# Altium project make_etf_great_again.PrjPcb
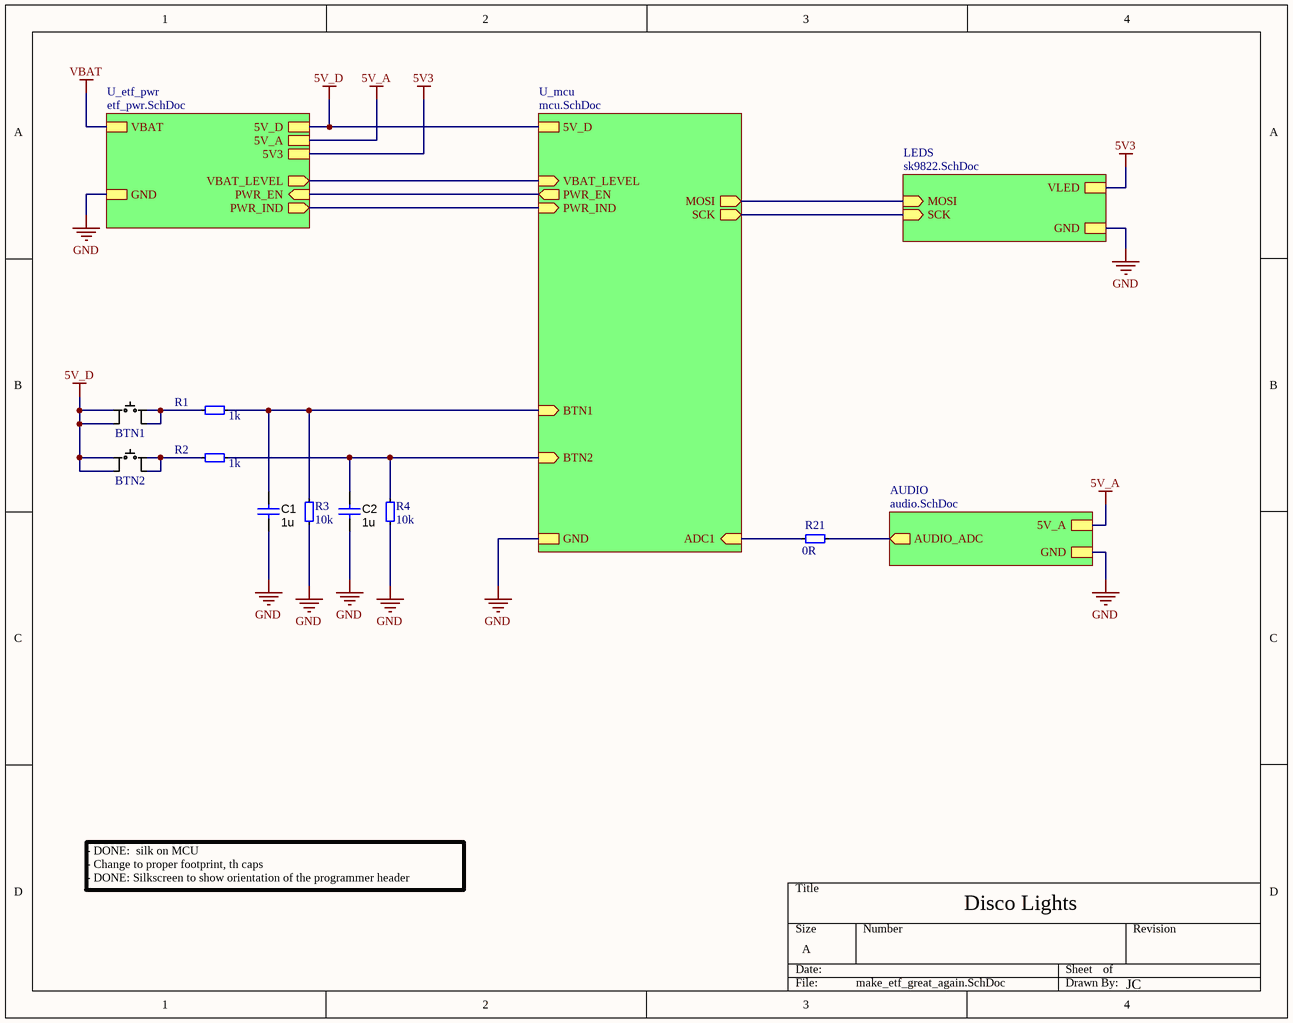
[diagram p0: make_etf_great_again.SchDoc]
Author: JC; Title: Disco Lights
5 sheets, 81 parts. Net scope: hierarchical (ports join the sheet entries above them; power ports are global).
Board file: etf_blink.PcbDoc
Sheets:
  make_etf_great_again.SchDoc
    LEDS = sk9822.SchDoc
    U_etf_pwr = etf_pwr.SchDoc
    AUDIO = audio.SchDoc
    U_mcu = mcu.SchDoc

## Sheet make_etf_great_again.SchDoc: Disco Lights
size A; SheetNumber: 1; SheetTotal: 5

### Parts
BTN1  Tactile Button  [SW_TS02-66-150-BK-160-LCR-D]  (value not drawn)
BTN2  Tactile Button  [SW_TS02-66-150-BK-160-LCR-D]  (value not drawn)
C1  value 1u  [1206_180]  (hidden comment: CAP, 1206)
C2  value 1u  [1206_180]  (hidden comment: CAP, 1206)
R1  value 1k  [TH]  (hidden comment: TH, resistor)
R2  value 1k  [TH]  (hidden comment: TH, resistor)
R3  value 10k  [TH]  (hidden comment: TH, resistor)
R4  value 10k  [TH]  (hidden comment: TH, resistor)
R21  value 0R  [0603]  (hidden comment: 0603, resistor)

### Sub-sheets
AUDIO = audio.SchDoc: AUDIO_ADC (out), 5V_A, GND
LEDS = sk9822.SchDoc: MOSI (in), SCK (in), VLED, GND
U_etf_pwr = etf_pwr.SchDoc: 5V_D, 5V_A, GND, VBAT_LEVEL (out), PWR_EN (in), VBAT, 5V3, PWR_IND (out)
U_mcu = mcu.SchDoc: MOSI (out), SCK (out), 5V_D, GND, BTN1 (in), BTN2 (in), ADC1 (in), PWR_EN (out), VBAT_LEVEL (in), PWR_IND (in)

### Nets
5V3: sheet LEDS/VLED, sheet U_etf_pwr/5V3
5V_A: sheet U_etf_pwr/5V_A, sheet AUDIO/5V_A
5V_D: BTN1.3 BTN1.4 BTN2.3 BTN2.4 ; sheet U_etf_pwr/5V_D, sheet U_mcu/5V_D
GND: C1.2 C2.2 R3.1 R4.1 ; sheet LEDS/GND, sheet U_etf_pwr/GND, sheet AUDIO/GND, sheet U_mcu/GND
ADC1: R21.1 ; sheet U_mcu/ADC1
AUDIO_ADC: R21.0 ; sheet AUDIO/AUDIO_ADC
BTN1: C1.1 R1.2 R3.2 ; sheet U_mcu/BTN1
BTN2: C2.1 R2.2 R4.2 ; sheet U_mcu/BTN2
MOSI: sheet LEDS/MOSI, sheet U_mcu/MOSI
PWR_EN: sheet U_etf_pwr/PWR_EN, sheet U_mcu/PWR_EN
PWR_IND: sheet U_etf_pwr/PWR_IND, sheet U_mcu/PWR_IND
SCK: sheet LEDS/SCK, sheet U_mcu/SCK
VBAT_LEVEL: sheet U_etf_pwr/VBAT_LEVEL, sheet U_mcu/VBAT_LEVEL
NetBTN1_1: BTN1.1 BTN1.2 R1.1
NetBTN2_1: BTN2.1 BTN2.2 R2.1

### Notes on the sheet
- - DONE:  silk on MCU
  - Change to proper footprint, th caps
  - DONE: Silkscreen to show orientation of the programmer header

### Library data of the parts
BTN1 BTN2 = TacButton TH: Tactile Switch Small Low; Mount: No; Value: Button
C1 C2 = CAP, 1206: Manufacturer Part Number: CC1206JKX7R7BB105; JLCPCB Part #: C527272; Mount: Yes
R1-R4 = TH, resistor: Mount: No
R21 = 0603, resistor: Manufacturer Part Number: RC0603JR-070RL; JLCPCB Part #: C95177; Mount: Yes

## Sheet sk9822.SchDoc: Disco Lights
size A; SheetNumber: 2; SheetTotal: 5
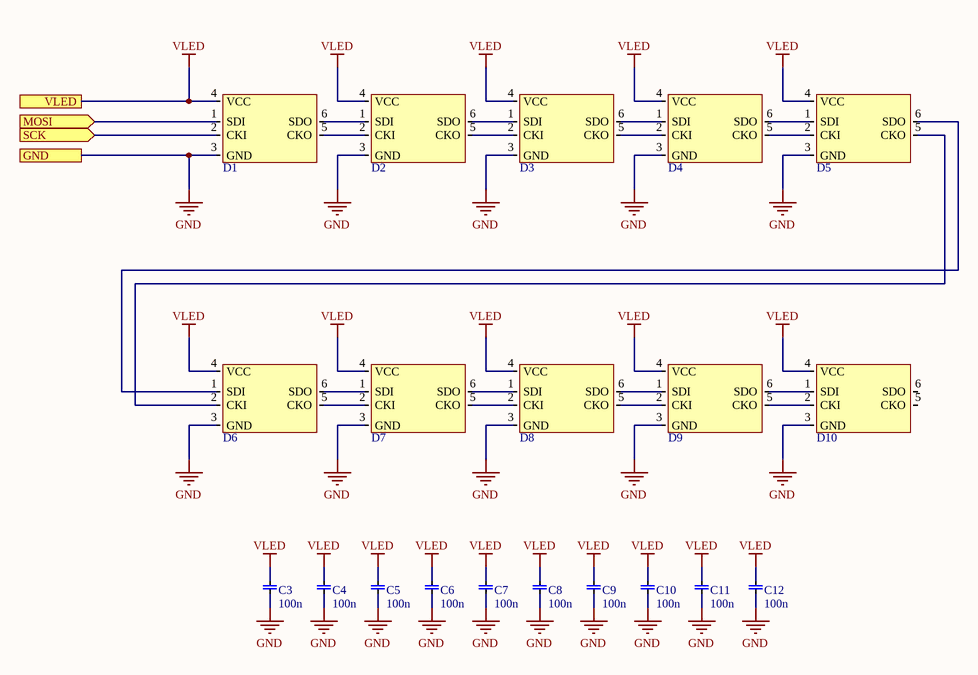
[diagram p1: sk9822.SchDoc]

### Parts
C3  value 100n  [1206, capasitor]  (hidden comment: 1206, capacitor)
C4  value 100n  [1206, capasitor]  (hidden comment: 1206, capacitor)
C5  value 100n  [1206, capasitor]  (hidden comment: 1206, capacitor)
C6  value 100n  [1206, capasitor]  (hidden comment: 1206, capacitor)
C7  value 100n  [1206, capasitor]  (hidden comment: 1206, capacitor)
C8  value 100n  [1206, capasitor]  (hidden comment: 1206, capacitor)
C9  value 100n  [1206, capasitor]  (hidden comment: 1206, capacitor)
C10  value 100n  [1206, capasitor]  (hidden comment: 1206, capacitor)
C11  value 100n  [1206, capasitor]  (hidden comment: 1206, capacitor)
C12  value 100n  [1206, capasitor]  (hidden comment: 1206, capacitor)
D1  Neo - SK9822  [SK9822]  (value not drawn)
D2  Neo - SK9822  [SK9822]  (value not drawn)
D3  Neo - SK9822  [SK9822]  (value not drawn)
D4  Neo - SK9822  [SK9822]  (value not drawn)
D5  Neo - SK9822  [SK9822]  (value not drawn)
D6  Neo - SK9822  [SK9822]  (value not drawn)
D7  Neo - SK9822  [SK9822]  (value not drawn)
D8  Neo - SK9822  [SK9822]  (value not drawn)
D9  Neo - SK9822  [SK9822]  (value not drawn)
D10  Neo - SK9822  [SK9822]  (value not drawn)

### Ports
GND, MOSI (in), SCK (in), VLED

### Nets
GND: C3.0 C4.0 C5.0 C6.0 C7.0 C8.0 C9.0 C10.0 C11.0 C12.0 D1.3(GND) D2.3(GND) D3.3(GND) D4.3(GND) D5.3(GND) D6.3(GND) D7.3(GND) D8.3(GND) D9.3(GND) D10.3(GND) ; port GND
VLED: C3.1 C4.1 C5.1 C6.1 C7.1 C8.1 C9.1 C10.1 C11.1 C12.1 D1.4(VCC) D2.4(VCC) D3.4(VCC) D4.4(VCC) D5.4(VCC) D6.4(VCC) D7.4(VCC) D8.4(VCC) D9.4(VCC) D10.4(VCC) ; port VLED  [project net 5V3]
MOSI: D1.1(SDI) ; port MOSI
SCK: D1.2(CKI) ; port SCK
NetD1_5: D1.5(CKO) D2.2(CKI)
NetD1_6: D1.6(SDO) D2.1(SDI)
NetD2_5: D2.5(CKO) D3.2(CKI)
NetD2_6: D2.6(SDO) D3.1(SDI)
NetD3_5: D3.5(CKO) D4.2(CKI)
NetD3_6: D3.6(SDO) D4.1(SDI)
NetD4_5: D4.5(CKO) D5.2(CKI)
NetD4_6: D4.6(SDO) D5.1(SDI)
NetD5_5: D5.5(CKO) D6.2(CKI)
NetD5_6: D5.6(SDO) D6.1(SDI)
NetD6_5: D6.5(CKO) D7.2(CKI)
NetD6_6: D6.6(SDO) D7.1(SDI)
NetD7_5: D7.5(CKO) D8.2(CKI)
NetD7_6: D7.6(SDO) D8.1(SDI)
NetD8_5: D8.5(CKO) D9.2(CKI)
NetD8_6: D8.6(SDO) D9.1(SDI)
NetD9_5: D9.5(CKO) D10.2(CKI)
NetD9_6: D9.6(SDO) D10.1(SDI)

Not connected (* = marked no-connect by the designer): D10 5(CKO) 6(SDO)

### Library data of the parts
C3-C12 = 1206, capacitor: Manufacturer Part Number: CL31B104KBCNNNC; JLCPCB Part #: C24497; Mount: Yes
D1-D10 = Neo - SK9822: JLCPCB Part #: C2829089; Manufacturer Part Number: SK9822; Mount: Yes

## Sheet etf_pwr.SchDoc: Disco Lights
size A4; SheetNumber: 3; SheetTotal: 5
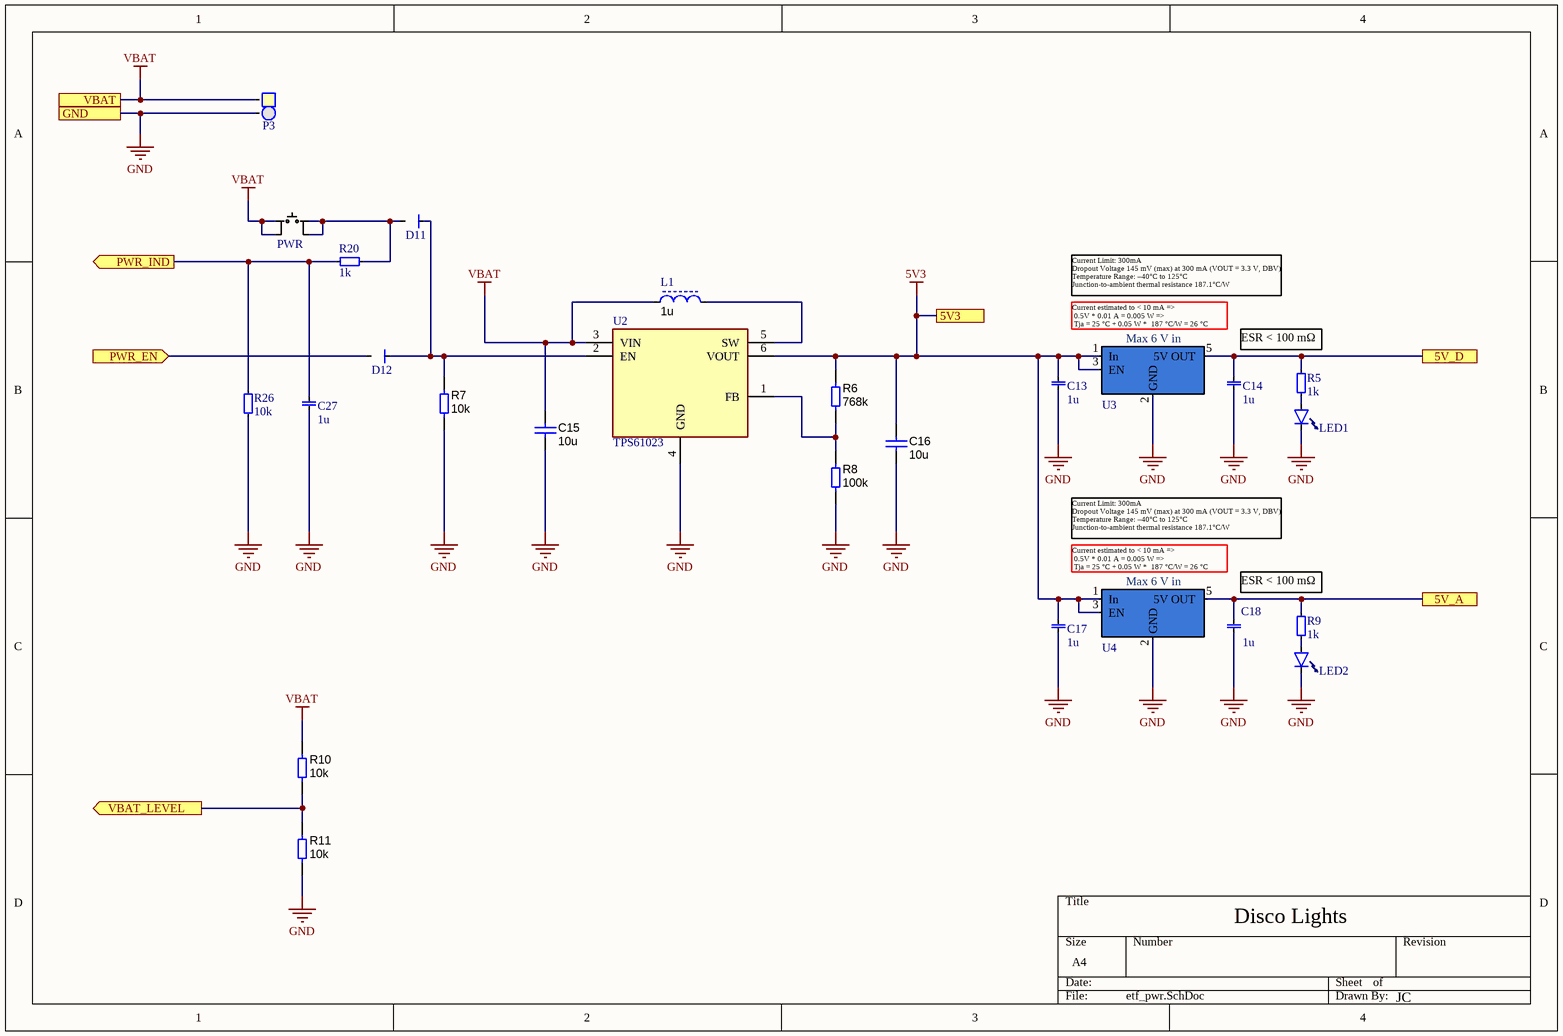
[diagram p2: etf_pwr.SchDoc]

### Parts
C13  value 1u  [0603 cap]  (hidden comment: 0603, capacitor)
C14  value 1u  [0603 cap]  (hidden comment: 0603, capacitor)
C15  value 10u  [1206_180]  (hidden comment: CAP, 1206)
C16  value 10u  [1206_180]  (hidden comment: CAP, 1206)
C17  value 1u  [0603 cap]  (hidden comment: 0603, capacitor)
C18  value 1u  [0603 cap]  (hidden comment: 0603, capacitor)
C27  value 1u  [0603 cap]  (hidden comment: 0603, capacitor)
D11  Diode, SMD  [SOD323]  (value not drawn)
D12  Diode, SMD  [SOD323]  (value not drawn)
L1  value 1u  [XEL4030-102MEC]  (hidden comment: Inductor, 1616)
LED1  0805, LED  [0805_led]  (value not drawn)
LED2  0805, LED  [0805_led]  (value not drawn)
P3  1x2 Pin Header  [padtwo_L]  (value not drawn)
PWR  Tactile Button  [SW_TS02-66-150-BK-160-LCR-D]  (value not drawn)
R5  value 1k  [0603]  (hidden comment: 0603, resistor)
R6  value 768k  [0603]  (hidden comment: RES, 0603)
R7  value 10k  [0603]  (hidden comment: RES, 0603)
R8  value 100k  [0603]  (hidden comment: RES, 0603)
R9  value 1k  [0603]  (hidden comment: 0603, resistor)
R10  value 10k  [0603]  (hidden comment: RES, 0603)
R11  value 10k  [0603]  (hidden comment: RES, 0603)
R20  value 1k  [0603]  (hidden comment: 0603, resistor)
R26  value 10k  [0603]  (hidden comment: 0603, resistor)
U2  TPS61023  [SOT50P160X60-6N]
U3  TPS7A20  [SOT23-5]  (value not drawn)
U4  TPS7A20  [SOT23-5]  (value not drawn)

### Ports
5V3, 5V_A, 5V_D, GND, PWR_EN (in), PWR_IND (out), VBAT, VBAT_LEVEL (out)

### Nets
5V3: C13.1 C16.1 C17.1 R6.2 U2.6(VOUT) U3.1(In) U3.3(EN) U4.1(In) U4.3(EN) ; port 5V3
5V_A: C18.1 R9.1 U4.5(5V_OUT) ; port 5V_A
5V_D: C14.1 R5.1 U3.5(5V_OUT) ; port 5V_D
GND: C13.0 C14.0 C15.2 C16.2 C17.0 C18.0 C27.0 LED1.0(Cathode) LED2.0(Cathode) P3.2 R7.1 R8.1 R11.1 R26.0 U2.4(GND) U3.2(GND) U4.2(GND) ; port GND
VBAT: C15.1 L1.2 P3.1 PWR.3 PWR.4 R10.2 U2.3(VIN) ; port VBAT
PWR_EN: D12.2 ; port PWR_EN
PWR_IND: C27.1 R20.0 R26.1 ; port PWR_IND
VBAT_LEVEL: R10.1 R11.2 ; port VBAT_LEVEL
NetD11_1: D11.1 D12.1 R7.2 U2.2(EN)
NetD11_2: D11.2 PWR.1 PWR.2 R20.1
NetL1_1: L1.1 U2.5(SW)
NetLED1_1: LED1.1 R5.0
NetLED2_1: LED2.1 R9.0
NetR6_1: R6.1 R8.2 U2.1(FB)

### Notes on the sheet
- Current Limit: 300mA
  Dropout Voltage 145 mV (max) at 300 mA (VOUT = 3.3 V, DBV)
  Temperature Range: –40°C to 125°C
  Junction-to-ambient thermal resistance 187.1°C/W
- (near U3) Current estimated to < 10 mA =>
  0.5V * 0.01 A = 0.005 W =>
  Tja = 25 °C + 0.05 W *  187 °C/W = 26 °C
- ESR < 100 mΩ
- (near U4) Current estimated to < 10 mA =>
  0.5V * 0.01 A = 0.005 W =>
  Tja = 25 °C + 0.05 W *  187 °C/W = 26 °C
- (in symbol TPS7A20) Max 6 V in

### Library data of the parts
C13 C14 C17 C18 C27 = 0603, capacitor: Manufacturer Part Number: GRM188R61H105KAALD; JLCPCB Part #: C77386; Mount: Yes
C15 C16 = CAP, 1206: Manufacturer Part Number: C3216X7R1C106KT000N; JLCPCB Part #: C342827; Mount: Yes
D11 D12 = Diode, SMD: Manufacturer Part Number: BAT760,115; JLCPCB Part #: C117941; Mount: Yes
L1 = Inductor, 1616: Shielded Power Inductor with Ferrite Core; AC Current: 1; Mount: No; DC Resistance: 1; Manufacturer Part Number: XEL4030-102MEC
LED1 LED2 = 0805, LED: Manufacturer Part Number: KP-2012SURCK; Value: 0805 LED; JLCPCB Part #: C598285; Mount: Yes
P3 = 1x2 Pin Header: 2.54 mm, TH; Mount: No; Value: 1x2 Pin Header
PWR = TacButton TH: Tactile Switch Small Low; Mount: No; Value: Button
R5 R9 R20 = 0603, resistor: Manufacturer Part Number: CR0603-FX-1001ELF; JLCPCB Part #: C203217; Mount: Yes
R6 = RES, 0603: Manufacturer Part Number: CR0603F768KP05Z; JLCPCB Part #: C245065; Mount: Yes
R7 R10 R11 = RES, 0603: Manufacturer Part Number: RC0603FR-0710KL; JLCPCB Part #: C98220; Mount: Yes
R8 = RES, 0603: Manufacturer Part Number: RC0603FR-07100KL; JLCPCB Part #: C14675; Mount: Yes
R26 = 0603, resistor: Manufacturer Part Number: RC0603FR-0710KL; JLCPCB Part #: C98220; Mount: Yes
U2 = TPS61023: TPS61023 3.7-A Boost Converter with 0.5-V Ultra-low Input Voltage; Manufacturer Part Number: TPS61023DRLR; JLCPCB Part #: C919459; Mount: Yes
U3 U4 = TPS7A20: 5V and 300-mA, Ultra-Low-Noise, Low-IQ, High PSRR LDO; Manufacturer Part Number: TPS7A2045PDBVR; JLCPCB Part #: C2873627; Mount: Yes

## Sheet audio.SchDoc: Disco Lights
size A; SheetNumber: 4; SheetTotal: 5
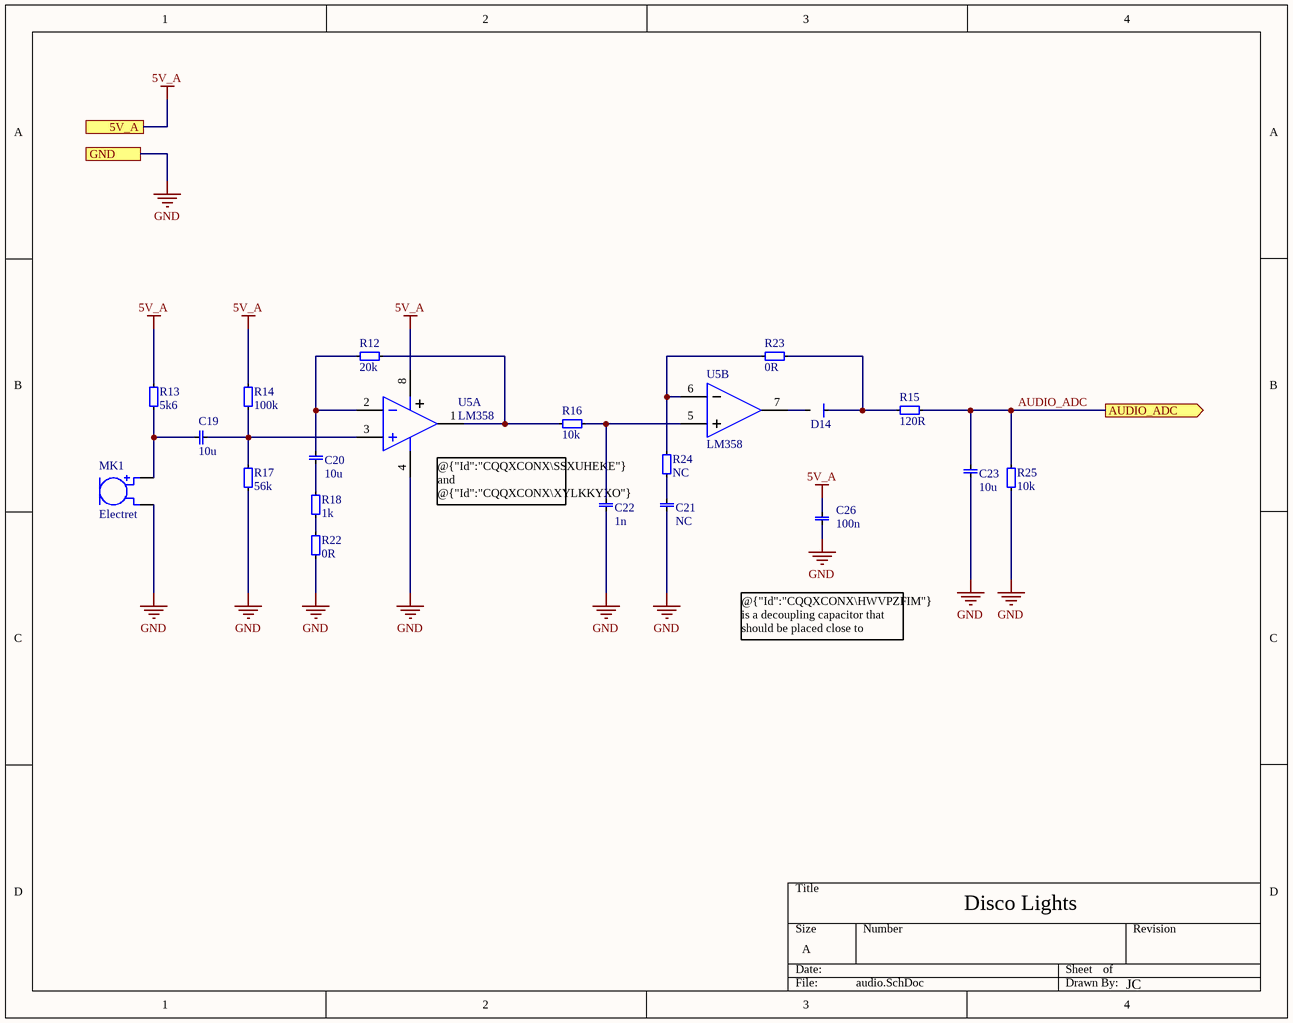
[diagram p3: audio.SchDoc]

### Parts
C19  value 10u  [0603 cap]  (hidden comment: 0603, capacitor)
C20  value 10u  [0603 cap]  (hidden comment: 0603, capacitor)
C21  value NC  [0603 cap]  (hidden comment: 0603, capacitor)
C22  value 1n  [0603 cap]  (hidden comment: 0603, capacitor)
C23  value 10u  [0603 cap]  (hidden comment: 0603, capacitor)
C26  value 100n  [0603 cap]  (hidden comment: 0603, capacitor)
D14  Diode, SMD  [SOD323]  (value not drawn)
MK1  Electret  [ElectretMic_9.7mm_6.7mm]
R12  value 20k  [0603]  (hidden comment: 0603, resistor)
R13  value 5k6  [0603]  (hidden comment: 0603, resistor)
R14  value 100k  [0603]  (hidden comment: 0603, resistor)
R15  value 120R  [0603]  (hidden comment: 0603, resistor)
R16  value 10k  [0603]  (hidden comment: 0603, resistor)
R17  value 56k  [0603]  (hidden comment: 0603, resistor)
R18  value 1k  [0603]  (hidden comment: 0603, resistor)
R22  value 0R  [0603]  (hidden comment: 0603, resistor)
R23  value 0R  [0603]  (hidden comment: 0603, resistor)
R24  value NC  [0603]  (hidden comment: 0603, resistor)
R25  value 10k  [0603]  (hidden comment: 0603, resistor)
U5  LM358  [SOIC8]  (parts A,B of 2)

### Ports
5V_A, AUDIO_ADC (out), GND

### Nets
5V_A: C26.1 R13.0 R14.0 U5.8(V+) ; port 5V_A
GND: C21.0 C22.0 C23.1 C26.0 MK1.2 R17.1 R22.0 R25.1 U5.4(V-) ; port GND
AUDIO_ADC: C23.0 R15.1 R25.0 ; port AUDIO_ADC
NetC19_0: C19.0 R14.1 R17.0 U5.3(IN+)
NetC19_1: C19.1 MK1.1 R13.1
NetC20_0: C20.0 R18.0
NetC20_1: C20.1 R12.0 U5.2(IN-)
NetC21_1: C21.1 R24.1
NetC22_1: C22.1 R16.1 U5.5(IN+)
NetD14_1: D14.1 R15.0 R23.1
NetD14_2: D14.2 U5.7(OUT2)
NetR12_1: R12.1 R16.0 U5.1(OUT1)
NetR18_1: R18.1 R22.1
NetR23_0: R23.0 R24.0 U5.6(IN-)

### Notes on the sheet
- (near U5) @{"Id":"CQQXCONX\SSXUHEKE"} and @{"Id":"CQQXCONX\XYLKKYXO"} should have a time constant of 110 ms (2.2 1/20 Hz)
- @{"Id":"CQQXCONX\HWVPZFIM"} is a decoupling capacitor that should be placed close to @{"Id":"CQQXCONX\QJIXHWMY"}/ @{"Id":"CQQXCONX\NZEVYOYY"}.

### Library data of the parts
C19 C20 C23 = 0603, capacitor: Manufacturer Part Number: TMK107BBJ106MA-T; JLCPCB Part #: C386081; Mount: Yes
C21 = 0603, capacitor: Mount: No
C22 C26 = 0603, capacitor: Manufacturer Part Number: CC0603KRX7R9BB102; Mount: Yes
  C22: JLCPCB Part #: C100040
  C26: JLCPCB Part #: C14663
D14 = Diode, SMD: Manufacturer Part Number: BAT760,115; JLCPCB Part #: C117941; Mount: Yes
MK1 = Electret Mic: D9.7mm H6.7mm, Electrokit art nr: 40290007; Mount: No
R12 = 0603, resistor: Manufacturer Part Number: RT0603BRD0720KL; JLCPCB Part #: C723637; Mount: Yes
R13 = 0603, resistor: Manufacturer Part Number: AC0603FR-075K6L; JLCPCB Part #: C138278; Mount: Yes
R14 = 0603, resistor: Manufacturer Part Number: RC0603FR-07100KL; JLCPCB Part #: C14675; Mount: Yes
R15 = 0603, resistor: Manufacturer Part Number: RC0603JR-07120RL; JLCPCB Part #: C114681; Mount: Yes
R16 R25 = 0603, resistor: as R26 on sheet etf_pwr; JLCPCB Part #: C98220; Mount: Yes
R17 = 0603, resistor: Manufacturer Part Number: C3216X7R1C106KT000N; JLCPCB Part #: C114630; Mount: Yes
R18 = 0603, resistor: as R5 on sheet etf_pwr; JLCPCB Part #: C203217; Mount: Yes
R22 R23 = 0603, resistor: Manufacturer Part Number: RC0603JR-070RL; JLCPCB Part #: C95177; Mount: Yes
R24 = 0603, resistor: Mount: No
U5 = LM358: Dual FET-Input Operational Amplifier; Value: 595-LM358P; Mount: No

## Sheet mcu.SchDoc: Disco Lights
size A4; SheetNumber: 5; SheetTotal: 5
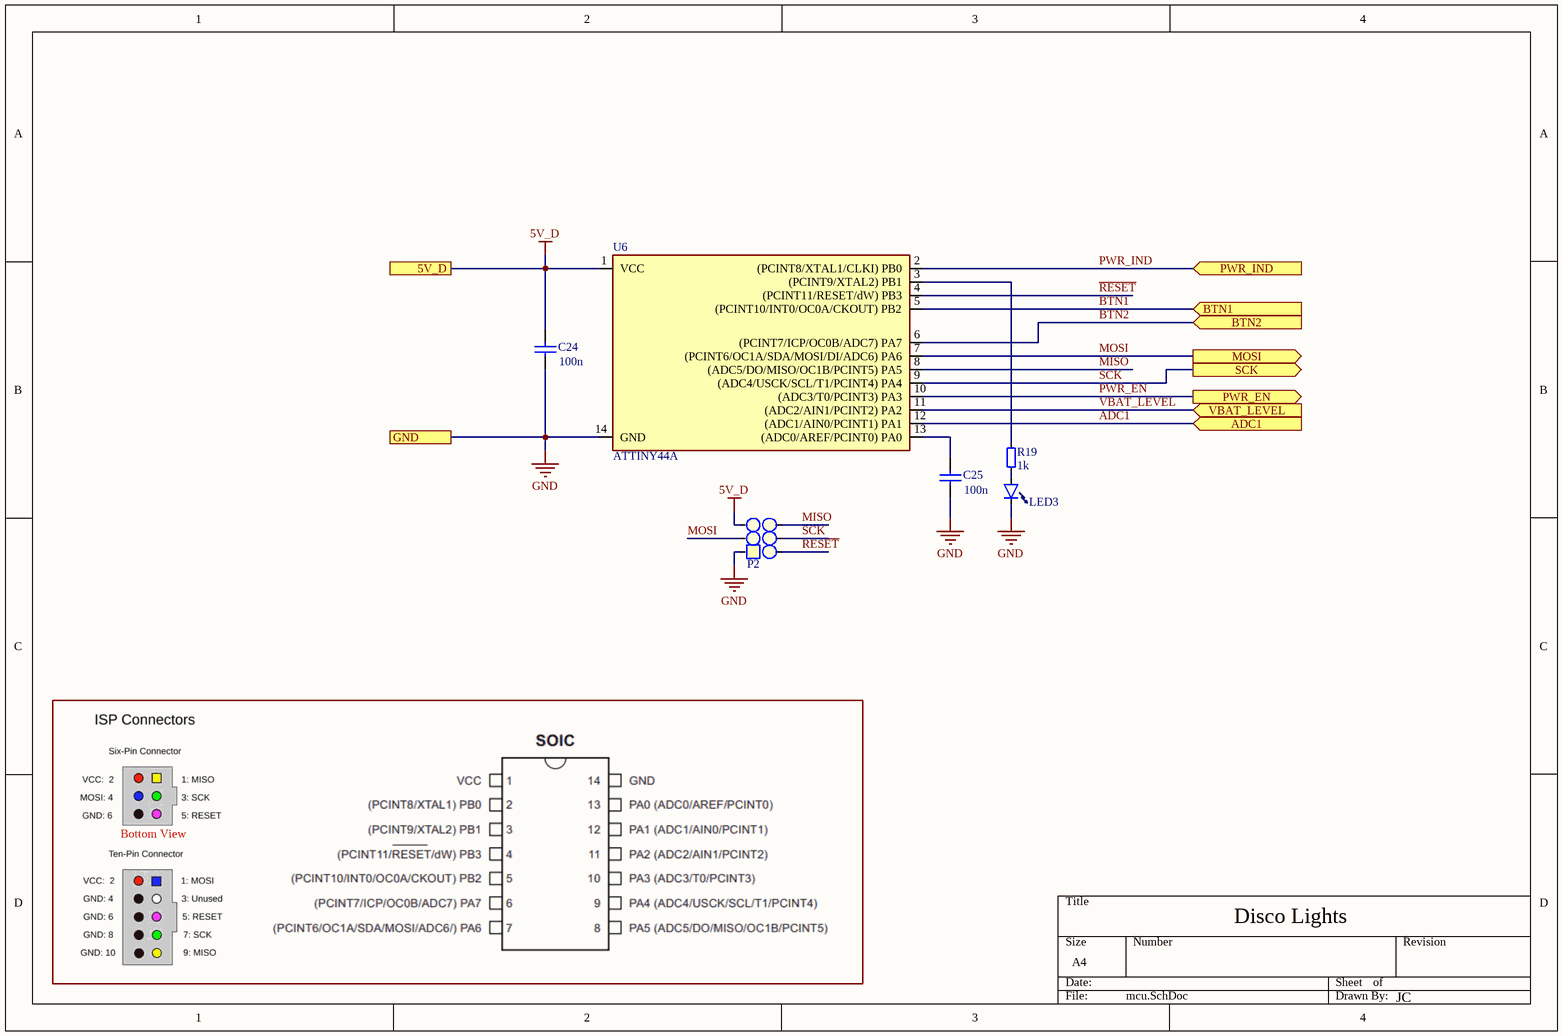
[diagram p4: mcu.SchDoc]

### Parts
C24  value 100n  [MMK7.5104K100K00L4BULK]  (hidden comment: CAP, TH)
C25  value 100n  [MMK7.5104K100K00L4BULK]  (hidden comment: CAP, TH)
LED3  0805, LED  [0805_led]  (value not drawn)
P2  2x3 Pin Header  [2x3 PH]  (value not drawn)
R19  value 1k  [0603]  (hidden comment: 0603, resistor)
U6  ATTINY44A  [DIP14]

### Ports
5V_D, ADC1 (in), BTN1 (in), BTN2 (in), GND, MOSI (out), PWR_EN (out), PWR_IND (in), SCK (out), VBAT_LEVEL (in)

### Nets
5V_D: C24.1 P2.3 U6.1(VCC) ; port 5V_D
GND: C24.2 C25.2 LED3.0(Cathode) P2.1 U6.14(GND) ; port GND
ADC1: U6.12((ADC1/AIN0/PCINT1)_PA1) ; port ADC1
BTN1: U6.5((PCINT10/INT0/OC0A/CKOUT)_PB2) ; port BTN1
BTN2: U6.6((PCINT7/ICP/OC0B/ADC7)_PA7) ; port BTN2
MISO: P2.4 U6.8((ADC5/DO/MISO/OC1B/PCINT5)_PA5)
MOSI: P2.2 U6.7((PCINT6/OC1A/SDA/MOSI/DI/ADC6)_PA6) ; port MOSI
PWR_EN: U6.10((ADC3/T0/PCINT3)_PA3) ; port PWR_EN
PWR_IND: U6.2((PCINT8/XTAL1/CLKI)_PB0) ; port PWR_IND
~{RESET}: P2.6 U6.4((PCINT11/RESET/dW)_PB3)
SCK: P2.5 U6.9((ADC4/USCK/SCL/T1/PCINT4)_PA4) ; port SCK
VBAT_LEVEL: U6.11((ADC2/AIN1/PCINT2)_PA2) ; port VBAT_LEVEL
NetC25_1: C25.1 U6.13((ADC0/AREF/PCINT0)_PA0)
NetLED3_1: LED3.1 R19.0
NetR19_1: R19.1 U6.3((PCINT9/XTAL2)_PB1)

### Notes on the sheet
- Bottom View

### Library data of the parts
C24 C25 = CAP, TH: Mount: No
LED3 = 0805, LED: as LED1 on sheet etf_pwr; JLCPCB Part #: C598285; Mount: Yes
P2 = 2x3 Pin Header: Value: 2x3 Pin Header, 2.54mm; Mount: No
R19 = 0603, resistor: as R5 on sheet etf_pwr; JLCPCB Part #: C203217; Mount: Yes
U6 = ATTINY44A: 8-bit microcontrollers based on the AVR® enhanced RISC / architecture.; Mount: No

## Nets that join several sheets
5V3: sk9822 (20 pins), etf_pwr (9 pins)
5V_A: etf_pwr (C18.1 R9.1 U4.5), audio (C26.1 R13.0 R14.0 U5.8)
5V_D: make_etf_great_again (BTN1.3 BTN1.4 BTN2.3 BTN2.4), etf_pwr (C14.1 R5.1 U3.5), mcu (C24.1 P2.3 U6.1)
GND: make_etf_great_again (C1.2 C2.2 R3.1 R4.1), sk9822 (20 pins), etf_pwr (17 pins), audio (9 pins), mcu (5 pins)
ADC1: make_etf_great_again (R21.1), mcu (U6.12)
AUDIO_ADC: make_etf_great_again (R21.0), audio (C23.0 R15.1 R25.0)
BTN1: make_etf_great_again (C1.1 R1.2 R3.2), mcu (U6.5)
BTN2: make_etf_great_again (C2.1 R2.2 R4.2), mcu (U6.6)
MOSI: sk9822 (D1.1), mcu (P2.2 U6.7)
PWR_EN: etf_pwr (D12.2), mcu (U6.10)
PWR_IND: etf_pwr (C27.1 R20.0 R26.1), mcu (U6.2)
SCK: sk9822 (D1.2), mcu (P2.5 U6.9)
VBAT_LEVEL: etf_pwr (R10.1 R11.2), mcu (U6.11)